# Altium schematic sheet secure_gateway.SchDoc
size A4; SheetNumber: 1; SheetTotal: 1
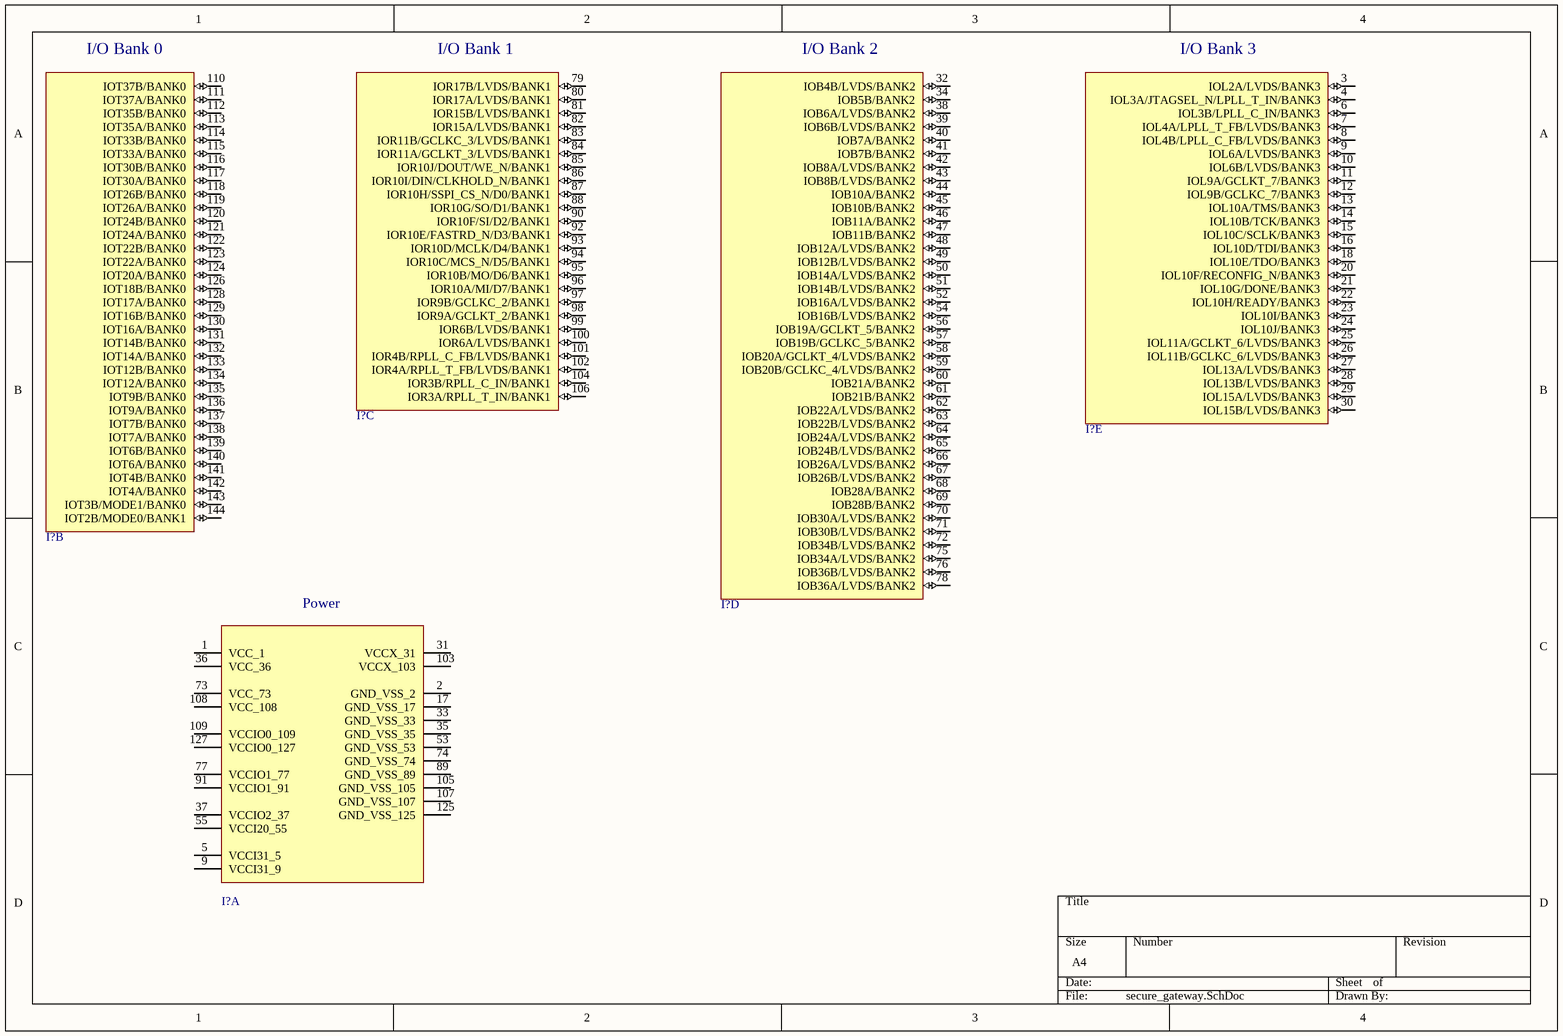
[diagram p0: secure_gateway.SchDoc]

## Parts
(Parts that share a designator on the sheet are numbered #1, #2 ... from top to bottom, then left to right.)
I?#1  IC GW1N-LV4LQ144 UM  [IC GW1N-LV4LQ144 UM]  (value not drawn)  (part B of 5)
I?#2  IC GW1N-LV4LQ144 UM  [IC GW1N-LV4LQ144 UM]  (value not drawn)  (part C of 5)
I?#3  IC GW1N-LV4LQ144 UM  [IC GW1N-LV4LQ144 UM]  (value not drawn)  (part D of 5)
I?#4  IC GW1N-LV4LQ144 UM  [IC GW1N-LV4LQ144 UM]  (value not drawn)  (part E of 5)
I?#5  IC GW1N-LV4LQ144 UM  [IC GW1N-LV4LQ144 UM]  (value not drawn)  (part A of 5)

## Nets

Not connected (* = marked no-connect by the designer): I?#1 110(IOT37B/BANK0) 111(IOT37A/BANK0) 112(IOT35B/BANK0) 113(IOT35A/BANK0) 114(IOT33B/BANK0) 115(IOT33A/BANK0) 116(IOT30B/BANK0) 117(IOT30A/BANK0) 118(IOT26B/BANK0) 119(IOT26A/BANK0) 120(IOT24B/BANK0) 121(IOT24A/BANK0) 122(IOT22B/BANK0) 123(IOT22A/BANK0) 124(IOT20A/BANK0) 126(IOT18B/BANK0) 128(IOT17A/BANK0) 129(IOT16B/BANK0) 130(IOT16A/BANK0) 131(IOT14B/BANK0) 132(IOT14A/BANK0) 133(IOT12B/BANK0) 134(IOT12A/BANK0) 135(IOT9B/BANK0) 136(IOT9A/BANK0) 137(IOT7B/BANK0) 138(IOT7A/BANK0) 139(IOT6B/BANK0) 140(IOT6A/BANK0) 141(IOT4B/BANK0) 142(IOT4A/BANK0) 143(IOT3B/MODE1/BANK0) 144(IOT2B/MODE0/BANK1); I?#2 79(IOR17B/LVDS/BANK1) 80(IOR17A/LVDS/BANK1) 81(IOR15B/LVDS/BANK1) 82(IOR15A/LVDS/BANK1) 83(IOR11B/GCLKC_3/LVDS/BANK1) 84(IOR11A/GCLKT_3/LVDS/BANK1) 85(IOR10J/DOUT/WE_N/BANK1) 86(IOR10I/DIN/CLKHOLD_N/BANK1) 87(IOR10H/SSPI_CS_N/D0/BANK1) 88(IOR10G/SO/D1/BANK1) 90(IOR10F/SI/D2/BANK1) 92(IOR10E/FASTRD_N/D3/BANK1) 93(IOR10D/MCLK/D4/BANK1) 94(IOR10C/MCS_N/D5/BANK1) 95(IOR10B/MO/D6/BANK1) 96(IOR10A/MI/D7/BANK1) 97(IOR9B/GCLKC_2/BANK1) 98(IOR9A/GCLKT_2/BANK1) 99(IOR6B/LVDS/BANK1) 100(IOR6A/LVDS/BANK1) 101(IOR4B/RPLL_C_FB/LVDS/BANK1) 102(IOR4A/RPLL_T_FB/LVDS/BANK1) 104(IOR3B/RPLL_C_IN/BANK1) 106(IOR3A/RPLL_T_IN/BANK1); I?#3 32(IOB4B/LVDS/BANK2) 34(IOB5B/BANK2) 38(IOB6A/LVDS/BANK2) 39(IOB6B/LVDS/BANK2) 40(IOB7A/BANK2) 41(IOB7B/BANK2) 42(IOB8A/LVDS/BANK2) 43(IOB8B/LVDS/BANK2) 44(IOB10A/BANK2) 45(IOB10B/BANK2) 46(IOB11A/BANK2) 47(IOB11B/BANK2) 48(IOB12A/LVDS/BANK2) 49(IOB12B/LVDS/BANK2) 50(IOB14A/LVDS/BANK2) 51(IOB14B/LVDS/BANK2) 52(IOB16A/LVDS/BANK2) 54(IOB16B/LVDS/BANK2) 56(IOB19A/GCLKT_5/BANK2) 57(IOB19B/GCLKC_5/BANK2) 58(IOB20A/GCLKT_4/LVDS/BANK2) 59(IOB20B/GCLKC_4/LVDS/BANK2) 60(IOB21A/BANK2) 61(IOB21B/BANK2) 62(IOB22A/LVDS/BANK2) 63(IOB22B/LVDS/BANK2) 64(IOB24A/LVDS/BANK2) 65(IOB24B/LVDS/BANK2) 66(IOB26A/LVDS/BANK2) 67(IOB26B/LVDS/BANK2) 68(IOB28A/BANK2) 69(IOB28B/BANK2) 70(IOB30A/LVDS/BANK2) 71(IOB30B/LVDS/BANK2) 72(IOB34B/LVDS/BANK2) 75(IOB34A/LVDS/BANK2) 76(IOB36B/LVDS/BANK2) 78(IOB36A/LVDS/BANK2); I?#4 3(IOL2A/LVDS/BANK3) 4(IOL3A/JTAGSEL_N/LPLL_T_IN/BANK3) 6(IOL3B/LPLL_C_IN/BANK3) 7(IOL4A/LPLL_T_FB/LVDS/BANK3) 8(IOL4B/LPLL_C_FB/LVDS/BANK3) 9(IOL6A/LVDS/BANK3) 10(IOL6B/LVDS/BANK3) 11(IOL9A/GCLKT_7/BANK3) 12(IOL9B/GCLKC_7/BANK3) 13(IOL10A/TMS/BANK3) 14(IOL10B/TCK/BANK3) 15(IOL10C/SCLK/BANK3) 16(IOL10D/TDI/BANK3) 18(IOL10E/TDO/BANK3) 20(IOL10F/RECONFIG_N/BANK3) 21(IOL10G/DONE/BANK3) 22(IOL10H/READY/BANK3) 23(IOL10I/BANK3) 24(IOL10J/BANK3) 25(IOL11A/GCLKT_6/LVDS/BANK3) 26(IOL11B/GCLKC_6/LVDS/BANK3) 27(IOL13A/LVDS/BANK3) 28(IOL13B/LVDS/BANK3) 29(IOL15A/LVDS/BANK3) 30(IOL15B/LVDS/BANK3); I?#5 1(VCC_1) 2(GND_VSS_2) 5(VCCI31_5) 9(VCCI31_9) 17(GND_VSS_17) 31(VCCX_31) 33(GND_VSS_33) 35(GND_VSS_35) 36(VCC_36) 37(VCCIO2_37) 53(GND_VSS_53) 55(VCCI20_55) 73(VCC_73) 74(GND_VSS_74) 77(VCCIO1_77) 89(GND_VSS_89) 91(VCCIO1_91) 103(VCCX_103) 105(GND_VSS_105) 107(GND_VSS_107) 108(VCC_108) 109(VCCIO0_109) 125(GND_VSS_125) 127(VCCIO0_127)

## Notes on the sheet
- (in symbol IC GW1N-LV4LQ144 UM, part A) Power; /
- (in symbol IC GW1N-LV4LQ144 UM, part B) I/O Bank 0
- (in symbol IC GW1N-LV4LQ144 UM, part C) I/O Bank 1
- (in symbol IC GW1N-LV4LQ144 UM, part D) I/O Bank 2
- (in symbol IC GW1N-LV4LQ144 UM, part E) I/O Bank 3

## Library data of the parts
I?#1-I?#5 = IC GW1N-LV4LQ144 UM: FPGA - Field Programmable Gate Array; Manufacturer: GOWIN; Manufacturer Part Number: GW1N-LV4LQ144C5/I4; Supply Voltage: 1.14V ~ 1.26V; Flash size: 256Kbits; DPRAM: 180Kbits; Distributor: Mouser; Distributor Part Number: 192-GW1NLV4LQ144C5I4; Last Revision Date: 13.5.2024.; Temperature Range: 0°C ~ +85°C; Part ID: *; Mounting: SMD; Status: Not Checked; DB Parameter 1: *; DB Parameter 2: *; DB Parameter 3: *; Production Status: *; Populated: *; ComponentLink1Description: Datasheet; ComponentLink1URL: https://eu.mouser.com/datasheet/2/1033/GW1N_series_of_FPGA_Products_Data_Sheet-1830682.pdf; ComponentLink2Description: Distributor; ComponentLink2URL: https://eu.mouser.com/ProductDetail/GOWIN-Semiconductor/GW1N-LV4LQ144C5-I4?qs=wnTfsH77Xs54528DK%252Byv5g%3D%3D; ComponentLink3Description: Manufacturer; ComponentLink3URL: https://www.gowinsemi.com/en/